# Altium schematic sheet StLink.SchDoc
size A4
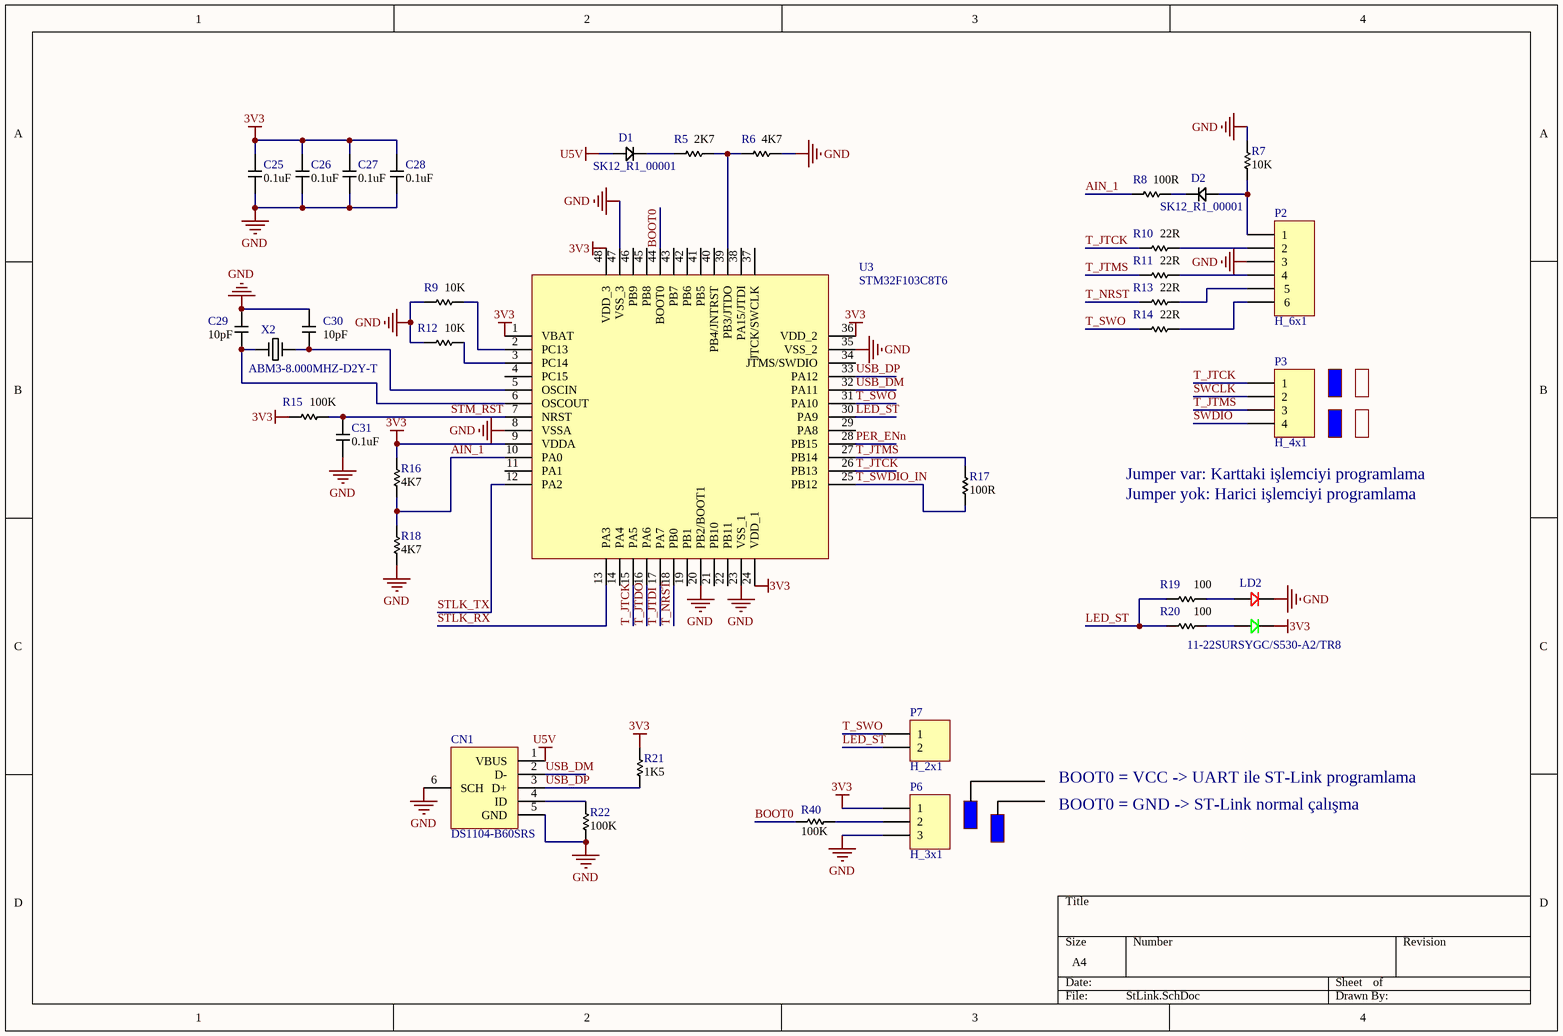
[diagram p0: StLink.SchDoc]

## Parts
C25  value 0.1uF  [Kemet_0805_X7R]  (hidden comment: C0805C104K3RACTU)
C26  value 0.1uF  [Kemet_0805_X7R]  (hidden comment: C0805C104K3RACTU)
C27  value 0.1uF  [Kemet_0805_X7R]  (hidden comment: C0805C104K3RACTU)
C28  value 0.1uF  [Kemet_0805_X7R]  (hidden comment: C0805C104K3RACTU)
C29  value 10pF  [Kemet_0805_X7R]  (hidden comment: C0805C104K3RACTU)
C30  value 10pF  [Kemet_0805_X7R]  (hidden comment: C0805C104K3RACTU)
C31  value 0.1uF  [Kemet_0805_X7R]  (hidden comment: C0805C104K3RACTU)
CN1  DS1104-B60SRS  [Connfly_DS1104-B60SRS]
D1  SK12_R1_00001  [Panjit_DO214AA_2]
D2  SK12_R1_00001  [Panjit_DO214AA_2]
LD2  11-22SURSYGC/S530-A2/TR8  [Everlight_11-22SURSYGC]
P2  H_6x1  [HEADER_HDRV6W65P254_6X1_1524X254H945]
P3  H_4x1  [HEADER_HDRV4W65P254_4X1_1016X254H945]
P6  H_3x1  [HEADER_HDRV3W65P254_3X1_762X254H945]
P7  H_2x1  [HEADER_HDRV2W65P254_2X1_508X254H945]
R5  value 2K7  [VISHAY_RESC205X125X50L35_30N]  (hidden comment: CRCW08050000Z0EA)
R6  value 4K7  [VISHAY_RESC205X125X50L35_30N]  (hidden comment: CRCW08050000Z0EA)
R7  value 10K  [VISHAY_RESC205X125X50L35_30N]  (hidden comment: CRCW08050000Z0EA)
R8  value 100R  [VISHAY_RESC205X125X50L35_30N]  (hidden comment: CRCW08050000Z0EA)
R9  value 10K  [VISHAY_RESC205X125X50L35_30N]  (hidden comment: CRCW08050000Z0EA)
R10  value 22R  [VISHAY_RESC205X125X50L35_30N]  (hidden comment: CRCW08050000Z0EA)
R11  value 22R  [VISHAY_RESC205X125X50L35_30N]  (hidden comment: CRCW08050000Z0EA)
R12  value 10K  [VISHAY_RESC205X125X50L35_30N]  (hidden comment: CRCW08050000Z0EA)
R13  value 22R  [VISHAY_RESC205X125X50L35_30N]  (hidden comment: CRCW08050000Z0EA)
R14  value 22R  [VISHAY_RESC205X125X50L35_30N]  (hidden comment: CRCW08050000Z0EA)
R15  value 100K  [VISHAY_RESC205X125X50L35_30N]  (hidden comment: CRCW08050000Z0EA)
R16  value 4K7  [VISHAY_RESC205X125X50L35_30N]  (hidden comment: CRCW08050000Z0EA)
R17  value 100R  [VISHAY_RESC205X125X50L35_30N]  (hidden comment: CRCW08050000Z0EA)
R18  value 4K7  [VISHAY_RESC205X125X50L35_30N]  (hidden comment: CRCW08050000Z0EA)
R19  value 100  [VISHAY_RESC205X125X50L35_30N]  (hidden comment: CRCW08050000Z0EA)
R20  value 100  [VISHAY_RESC205X125X50L35_30N]  (hidden comment: CRCW08050000Z0EA)
R21  value 1K5  [VISHAY_RESC205X125X50L35_30N]  (hidden comment: CRCW08050000Z0EA)
R22  value 100K  [VISHAY_RESC205X125X50L35_30N]  (hidden comment: CRCW08050000Z0EA)
R40  value 100K  [VISHAY_RESC205X125X50L35_30N]  (hidden comment: CRCW08050000Z0EA)
U3  STM32F103C8T6  [STM_QFP48P50_900X900X160L60X22N]
X2  ABM3-8.000MHZ-D2Y-T  [ABRACON_XTALDFN2_500X320X130L130X200N]

## Nets
3V3: C25.2 C26.2 C27.2 C28.2 LD2.4(G-) P6.1 R15.1 R16.2 R21.2 U3.1(VBAT) U3.9(VDDA) U3.24(VDD_1) U3.36(VDD_2) U3.48(VDD_3)
GND: C25.1 C26.1 C27.1 C28.1 C29.2 C30.2 C31.1 CN1.5(GND) CN1.6(SCH) LD2.2(R-) P2.3 P6.3 R6.2 R7.2 R9.1 R12.1 R18.1 R22.2 U3.8(VSSA) U3.20(PB2/BOOT1) U3.23(VSS_1) U3.35(VSS_2) U3.47(VSS_3)
U5V: CN1.1(VBUS) D1.1(A)
AIN_1: R8.2 R16.1 R18.2 U3.10(PA0)
BOOT0: R40.2 U3.44(BOOT0)
LED_ST: P7.2 R19.2 R20.2 U3.30(PA9)
PER_ENn: U3.28(PB15)
STLK_RX: U3.13(PA3)
STLK_TX: U3.12(PA2)
STM_RST: C31.2 R15.2 U3.7(NRST)
SWCLK: P3.2
SWDIO: P3.4
T_JTCK: P3.1 R10.2 U3.15(PA5) U3.26(PB13)
T_JTDI: U3.17(PA7)
T_JTDO: U3.16(PA6)
T_JTMS: P3.3 R11.2 R17.1 U3.27(PB14)
T_NRST: R13.2 U3.18(PB0)
T_SWDIO_IN: R17.2 U3.25(PB12)
T_SWO: P7.1 R14.2 U3.31(PA10)
USB_DM: CN1.2(D-) U3.32(PA11)
USB_DP: CN1.3(D+) R21.1 U3.33(PA12)
NetC29_1: C29.1 U3.6(OSCOUT) X2.1
NetC30_1: C30.1 U3.5(OSCIN) X2.2
NetCN1_4: CN1.4(ID) R22.1
NetD1_2: D1.2(C) R5.1
NetD2_1: D2.1(A) P2.1 R7.1
NetD2_2: D2.2(C) R8.1
NetLD2_1: LD2.1(R+) R19.1
NetLD2_3: LD2.3(G+) R20.1
NetP2_2: P2.2 R10.1
NetP2_4: P2.4 R11.1
NetP2_5: P2.5 R13.1
NetP2_6: P2.6 R14.1
NetP6_2: P6.2 R40.1
NetR5_2: R5.2 R6.1 U3.39(PB3/JTDO)
NetR9_2: R9.2 U3.2(PC13)
NetR12_2: R12.2 U3.3(PC14)

Not connected (* = marked no-connect by the designer): U3 4(PC15) 11(PA1) 14(PA4) 19(PB1) 21(PB10) 22(PB11) 29(PA8) 34(JTMS/SWDIO) 37(JTCK/SWCLK) 38(PA15/JTDI) 40(PB4/JNTRST) 41(PB5) 42(PB6) 43(PB7) 45(PB8) 46(PB9)

## Notes on the sheet
- (near P3) Jumper var: Karttaki işlemciyi programlama
- Jumper yok: Harici işlemciyi programlama
- BOOT0 = VCC -> UART ile ST-Link programlama
- BOOT0 = GND -> ST-Link normal çalışma

## Library data of the parts
C25-C31 = C0805C104K3RACTU: Cap_0805_0.1uF_25VDC_Kemet; Manufacturer: Kemet; Voltage: 25VDC; Tolerance: 10%; Dimensions: 2x1.25x0.9; Mounting Type: SMT; Package: 0805; Purchase Link: https://www.ozdisan.com/pasif-komponentler/kondansatorler/smd-kondansatorler-mlcc/C0805C105K4RACTU
CN1 = DS1104-B60SRS: UsbConn_Mini_5Pin_SMT_Connfly
D1 D2 = SK12_R1_00001: Schottky_1A_0.6V_20V_Panjit; Manufacturer: Panjit; Forward Current: 1A; Forward Voltage: 0.6V; Reverse Voltage: 20V; Package: DO214AA; Dimensions: -; Mounting Type: SMD; Purchase Link: https://www.ozdisan.com/guc-yari-iletkenleri/diyot-modul-diyot-dogrultucular/schottky-diyotlar/SK12R100001
LD2 = 11-22SURSYGC/S530-A2/TR8: Led_RG_1.7-2.4V_25mA_Everlight; Forward Current: 25mA; Color: RG; Manufacturer: Everlight; Forward Voltage: 1.7-2.4V; Package: 1206; Dimensions: -; Mounting Type: SMT; Purchase Link: https://www.ozdisan.com/led-led-aydinlatma-cozumleri/led-komponentler/renkli-led-sinyal/11-22SURSYGCS530-A2TR8
P2 = H_6x1: Head_6x1_2.54; Pitch: 2.54mm; Position of Pins: V; Manufacturer: -; Number of Pins: 6x1; Mounting Type: TH; Purchase Link: -; Dimensions: -
P3 = H_4x1: Head_4x1_2.54; Pitch: 2.54mm; Position of Pins: V; Manufacturer: -; Number of Pins: 4x1; Mounting Type: TH; Purchase Link: -; Dimensions: -
P6 = H_3x1: Head_3x1_2.54; Pitch: 2.54mm; Position of Pins: V; Manufacturer: -; Number of Pins: 3x1; Mounting Type: TH; Purchase Link: -; Dimensions: -
P7 = H_2x1: Head_2x1_2.54; Pitch: 2.54mm; Position of Pins: V; Manufacturer: -; Number of Pins: 2x1; Mounting Type: TH; Purchase Link: -; Dimensions: -
R5-R22 R40 = CRCW08050000Z0EA: Res_0805_0R_1/8W_Vishay; Manufacturer: Vishay; Power: 1/8W; Tolerance: Jumper; Dimensions: 2x1.25x0.45; Mounting Type: SMT; Package: 0805; Purchase Link: https://www.ozdisan.com/pasif-komponentler/direncler/smt-smd-direncler/CRCW08050000Z0EA
U3 = STM32F103C8T6: Microcontroller_STM; Manufacturer: STM; Purchase Link: https://ozdisan.com/entegre-devreler-ics/embedded-entegre-devreler/ic-mikroislemciler/STM32F103C8T6; Mounting Type: SMT; Package: LQFP48
X2 = ABM3-8.000MHZ-D2Y-T: Crystal_8MHz_18pF_140R_20PPM_30PPM_Abracon; Load Capacitance: 18pF; ESR: 140R; Frequency Stability: 30PPM; Frequency Tolerance: 20PPM; Frequency: 8MHz; Manufacturer: Abracon; Dimensions: 5x3.2x1.3; Package: ABM3; Mounting Type: SMT; Purchase Link: https://www.ozdisan.com/pasif-komponentler/kristaller-osilatorler-rezanatorler/kristal/ABM3-8-000MHZ-D2Y-T